# Altium project ZS-001.PrjPcb
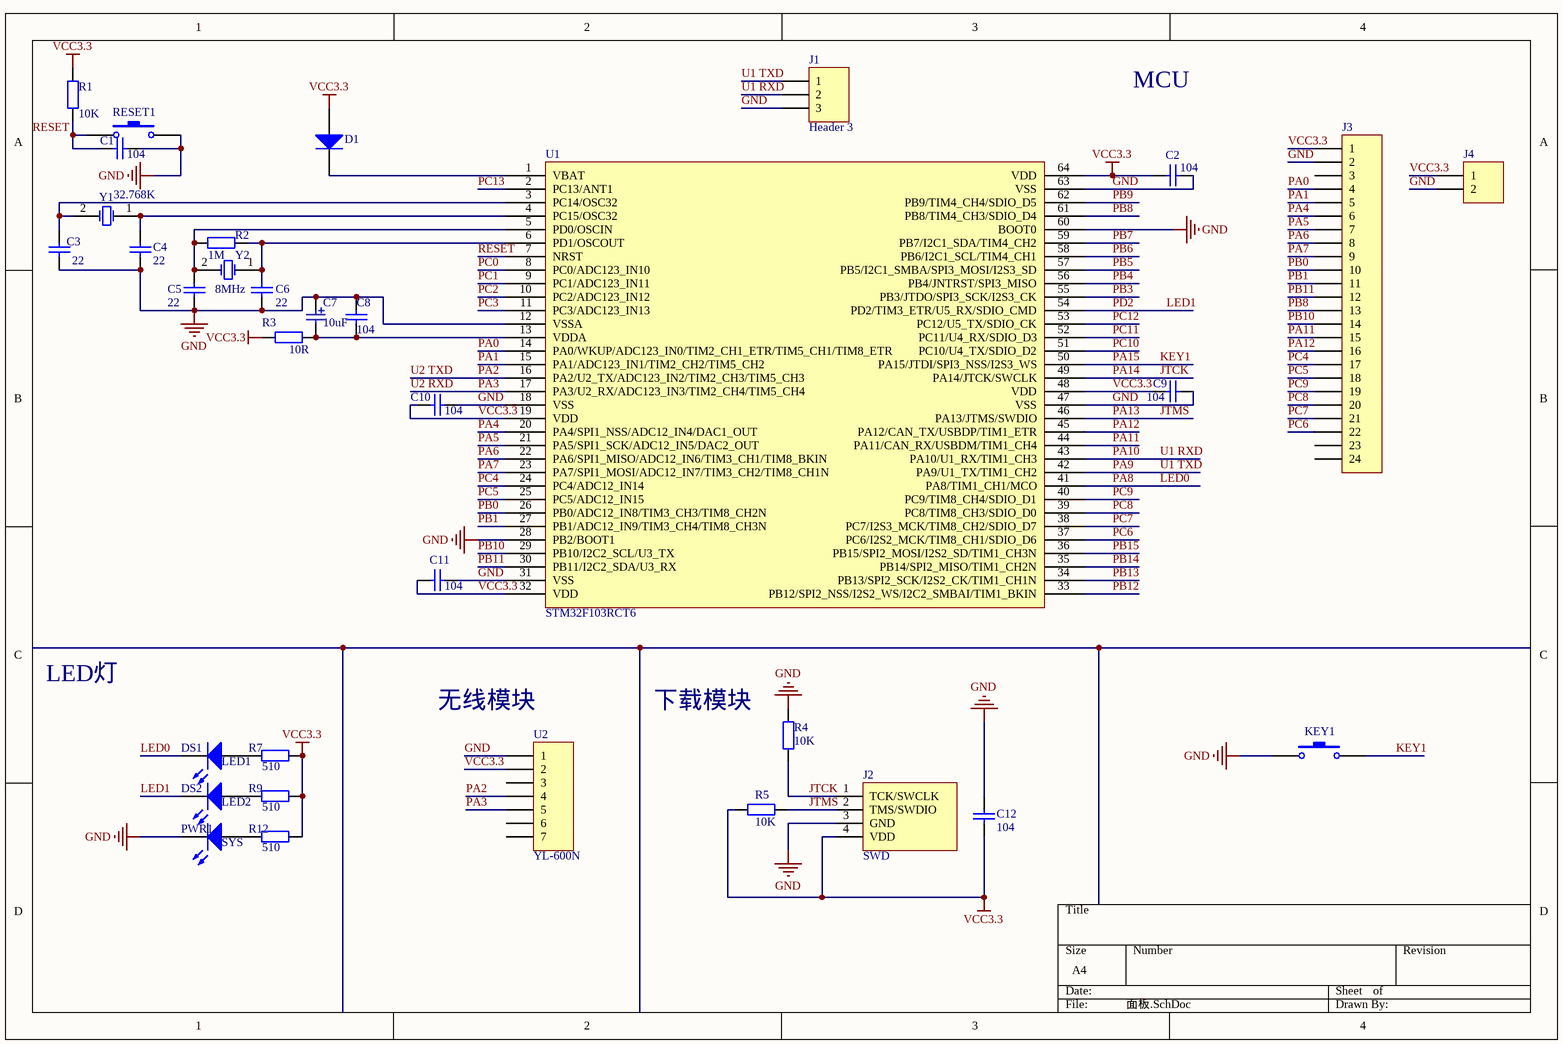
[diagram p0: 面板.SchDoc]
3 sheets, 130 parts. Net scope: global (net labels, ports and power ports of the same name join across sheets).
Board file: Super.PcbDoc
Sheets:
  面板.SchDoc
  基板.SchDoc
  基板1.SchDoc

## Sheet 面板.SchDoc
size A4

### Parts
(Parts that share a designator on the sheet are numbered #1, #2 ... from top to bottom, then left to right.)
C1  value 104  [0805C]  (hidden comment: Cap)
C2  value 104  [0805C]  (hidden comment: Cap)
C3  value 22  [0805C]  (hidden comment: Cap)
C4  value 22  [0805C]  (hidden comment: Cap)
C5  value 22  [0805C]  (hidden comment: Cap)
C6  value 22  [0805C]  (hidden comment: Cap)
C7  10uF  [3216T]
C8  value 104  [0805c]  (hidden comment: Cap)
C9  value 104  [0805C]  (hidden comment: Cap)
C10  value 104  [0805C]  (hidden comment: Cap)
C11  value 104  [0805C]  (hidden comment: Cap)
C12  value 104  [0805C]  (hidden comment: Cap)
D1  Diode 1N914  [1206]  (value not drawn)
DS1  LED1  [0805-D]
DS2  LED2  [0805-D]
J1#1  Header 3  [HDR1X3]
J2#1  SWD  [SWD]
J3#1  Header 24  [ffc]  (value not drawn)
J4#1  Header 2  [HDR1X2]  (value not drawn)
KEY1  SW-PB  [SWITCH]  (value not drawn)
PWR1  SYS  [0805-D]
R1  value 10K  [0805]  (hidden comment: Res2)
R2  value 1M  [0805]  (hidden comment: Res2)
R3  value 10R  [0805]  (hidden comment: Res2)
R4  value 10K  [0805]  (hidden comment: Res2)
R5  value 10K  [0805]  (hidden comment: Res2)
R7  value 510  [0805]
R9#1  value 510  [0805]
R12#1  value 510  [0805]
RESET1  SW-PB  [SWITCH]  (value not drawn)
U1#1  STM32F103RCT6  [STM32F103RCT6]
U2#1  YL-600N  [HDR1X7]
Y1  XTAL  [tc-26]  (value not drawn)
Y2  8MHz  [Y2]

### Nets
GND: C1.2 C2.2 C3.1 C4.1 C5.1 C6.2 C7.1 C8.2 C9.2 C10.1 C11.2 C12.1 J1#1.3 J2#1.3(GND) J3#1.2 J4#1.2 KEY1.1 PWR1.2(K) R4.1 RESET1.2 U1#1.12(VSSA) U1#1.18(VSS) U1#1.28(PB2/BOOT1) U1#1.31(VSS) U1#1.47(VSS) U1#1.60(BOOT0) U1#1.63(VSS) U2#1.1
VCC3.3: C2.1 C9.1 C10.2 C11.1 C12.2 D1.1(A) J2#1.4(VDD) J3#1.1 J4#1.1 R1.2 R3.2 R5.2 R7.2 R9#1.2 R12#1.2 U1#1.19(VDD) U1#1.32(VDD) U1#1.48(VDD) U1#1.64(VDD) U2#1.2
32.768K: C3.2 U1#1.3(PC14/OSC32) Y1.2(OSC2)
JTCK: J2#1.1(TCK/SWCLK) R4.2 U1#1.49(PA14/JTCK/SWCLK)  [also labelled PA14]
JTMS: J2#1.2(TMS/SWDIO) R5.1 U1#1.46(PA13/JTMS/SWDIO)  [also labelled PA13]
KEY1: KEY1.2 U1#1.50(PA15/JTDI/SPI3_NSS/I2S3_WS)  [also labelled PA15]
LED0: DS1.2(K) U1#1.41(PA8/TIM1_CH1/MCO)  [also labelled PA8]
LED1: DS2.2(K) U1#1.54(PD2/TIM3_ETR/U5_RX/SDIO_CMD)  [also labelled PD2]
PA0: J3#1.4 U1#1.14(PA0/WKUP/ADC123_IN0/TIM2_CH1_ETR/TIM5_CH1/TIM8_ETR)
PA1: J3#1.5 U1#1.15(PA1/ADC123_IN1/TIM2_CH2/TIM5_CH2)
PA2: U1#1.16(PA2/U2_TX/ADC123_IN2/TIM2_CH3/TIM5_CH3) U2#1.4  [also labelled U2 TXD]
PA3: U1#1.17(PA3/U2_RX/ADC123_IN3/TIM2_CH4/TIM5_CH4) U2#1.5  [also labelled U2 RXD]
PA4: J3#1.6 U1#1.20(PA4/SPI1_NSS/ADC12_IN4/DAC1_OUT)
PA5: J3#1.7 U1#1.21(PA5/SPI1_SCK/ADC12_IN5/DAC2_OUT)
PA6: J3#1.8 U1#1.22(PA6/SPI1_MISO/ADC12_IN6/TIM3_CH1/TIM8_BKIN)
PA7: J3#1.9 U1#1.23(PA7/SPI1_MOSI/ADC12_IN7/TIM3_CH2/TIM8_CH1N)
PA9: J1#1.1 U1#1.42(PA9/U1_TX/TIM1_CH2)  [also labelled U1 TXD]
PA10: J1#1.2 U1#1.43(PA10/U1_RX/TIM1_CH3)  [also labelled U1 RXD]
PA11: J3#1.15 U1#1.44(PA11/CAN_RX/USBDM/TIM1_CH4)
PA12: J3#1.16 U1#1.45(PA12/CAN_TX/USBDP/TIM1_ETR)
PB0: J3#1.10 U1#1.26(PB0/ADC12_IN8/TIM3_CH3/TIM8_CH2N)
PB1: J3#1.11 U1#1.27(PB1/ADC12_IN9/TIM3_CH4/TIM8_CH3N)
PB3: U1#1.55(PB3/JTDO/SPI3_SCK/I2S3_CK)
PB4: U1#1.56(PB4/JNTRST/SPI3_MISO)
PB5: U1#1.57(PB5/I2C1_SMBA/SPI3_MOSI/I2S3_SD)
PB6: U1#1.58(PB6/I2C1_SCL/TIM4_CH1)
PB7: U1#1.59(PB7/I2C1_SDA/TIM4_CH2)
PB8: J3#1.13 U1#1.61(PB8/TIM4_CH3/SDIO_D4)
PB9: U1#1.62(PB9/TIM4_CH4/SDIO_D5)
PB10: J3#1.14 U1#1.29(PB10/I2C2_SCL/U3_TX)
PB11: J3#1.12 U1#1.30(PB11/I2C2_SDA/U3_RX)
PB12: U1#1.33(PB12/SPI2_NSS/I2S2_WS/I2C2_SMBAI/TIM1_BKIN)
PB13: U1#1.34(PB13/SPI2_SCK/I2S2_CK/TIM1_CH1N)
PB14: U1#1.35(PB14/SPI2_MISO/TIM1_CH2N)
PB15: U1#1.36(PB15/SPI2_MOSI/I2S2_SD/TIM1_CH3N)
PC0: U1#1.8(PC0/ADC123_IN10)
PC1: U1#1.9(PC1/ADC123_IN11)
PC2: U1#1.10(PC2/ADC123_IN12)
PC3: U1#1.11(PC3/ADC123_IN13)
PC4: J3#1.17 U1#1.24(PC4/ADC12_IN14)
PC5: J3#1.18 U1#1.25(PC5/ADC12_IN15)
PC6: J3#1.22 U1#1.37(PC6/I2S2_MCK/TIM8_CH1/SDIO_D6)
PC7: J3#1.21 U1#1.38(PC7/I2S3_MCK/TIM8_CH2/SDIO_D7)
PC8: J3#1.20 U1#1.39(PC8/TIM8_CH3/SDIO_D0)
PC9: J3#1.19 U1#1.40(PC9/TIM8_CH4/SDIO_D1)
PC10: U1#1.51(PC10/U4_TX/SDIO_D2)
PC11: U1#1.52(PC11/U4_RX/SDIO_D3)
PC12: U1#1.53(PC12/U5_TX/SDIO_CK)
PC13: U1#1.2(PC13/ANT1)
RESET: U1#1.7(NRST)
NetC1_1: C1.1 R1.1 RESET1.1
NetC4_2: C4.2 U1#1.4(PC15/OSC32) Y1.1(OSC1)
NetC5_2: C5.2 R2.2 U1#1.5(PD0/OSCIN) Y2.2(OSC2)
NetC6_1: C6.1 R2.1 U1#1.6(PD1/OSCOUT) Y2.1(OSC1)
NetC7_2: C7.2 C8.1 R3.1 U1#1.13(VDDA)
NetD1_2: D1.2(K) U1#1.1(VBAT)
NetDS1_1: DS1.1(A) R7.1
NetDS2_1: DS2.1(A) R9#1.1
NetPWR1_1: PWR1.1(A) R12#1.1

Not connected (* = marked no-connect by the designer): J3#1 3 23 24; U2#1 3 6 7

### Notes on the sheet
- LED灯
- 无线模块
- 下载模块
- Labels drawn without touching a wire or pin: MCU, RESET

### Library data of the parts
C1-C6 C8-C12 = Cap: Capacitor; Published: 8-Jun-2000; LatestRevisionDate: 17-Jul-2002; LatestRevisionNote: Re-released for DXP Platform.; PackageReference: RAD-0.3; Publisher: Altium Limited; PackageDescription: Radial Cap, Thru-Hole; 2 Leads; 0.3 in Pin Spacing
C7 = CAP-POL1
D1 = Diode 1N914: High Conductance Fast Diode; Published: 8-Jun-2000; LatestRevisionDate: 17-Jul-2002; LatestRevisionNote: Re-released for DXP Platform.; DatasheetVersion: 1997; PackageReference: DO-35; Publisher: Altium Limited; PackageDescription: Diode, Axial; Body 3.8 x 1.9 mm (LxDia. max), Lead Dia. 0.53 mm (max); Code_JEDEC: DO-204-AH; ComponentLink1Description: Manufacturer Link; ComponentLink1URL: http://www.fairchildsemi.com/; ComponentLink2Description: Datasheet; ComponentLink2URL: http://www.fairchildsemi.com/ds/1N%2F1N4448.pdf
DS1 DS2 PWR1 = LED0: Typical INFRARED GaAs LED; Published: 8-Jun-2000; LatestRevisionDate: 08-Jul-2005; LatestRevisionNote: Mech Layer 1 removed.; PackageReference: LED-0; Publisher: Altium Limited; PackageDescription: LED; 2 Leads
J1#1 = Header 3: Header, 3-Pin; LatestRevisionDate: 17-Jul-2002; LatestRevisionNote: Re-released for DXP Platform.; Publisher: Altium Limited
J3#1 = Header 24: Header, 24-Pin; LatestRevisionDate: 17-Jul-2002; LatestRevisionNote: Re-released for DXP Platform.; Publisher: Altium Limited
J4#1 = Header 2: Header, 2-Pin; LatestRevisionDate: 17-Jul-2002; LatestRevisionNote: Re-released for DXP Platform.; Publisher: Altium Limited
KEY1 RESET1 = SW-PB: Switch; Published: 24-Mar-1999; LatestRevisionDate: 17-Jul-2002; LatestRevisionNote: Re-released for DXP Platform.; PackageReference: SPST-2; Publisher: Altium Limited; PackageDescription: Switch; 2 Leads
R1-R5 R7 R9#1 R12#1 = Res2: Resistor; Published: 8-Jun-2000; LatestRevisionDate: 17-Jul-2002; LatestRevisionNote: Re-released for DXP Platform.; PackageReference: AXIAL-0.4; Publisher: Altium Limited; PackageDescription: Axial Device, Thru-Hole; 2 Leads; 0.4 in Pin Spacing
U2#1 = Header 7: Header, 7-Pin; LatestRevisionDate: 17-Jul-2002; LatestRevisionNote: Re-released for DXP Platform.; Publisher: Altium Limited
Y1 Y2 = XTAL: Crystal Oscillator; Published: 8-Jun-2000; LatestRevisionDate: 17-Jul-2002; LatestRevisionNote: Re-released for DXP Platform.; PackageReference: R38; Publisher: Altium Limited; PackageDescription: Crystal, Thru-Hole; 2 Leads; Body 3.1 x 8.2 mm (Dia.xH)

## Sheet 基板.SchDoc
size A4
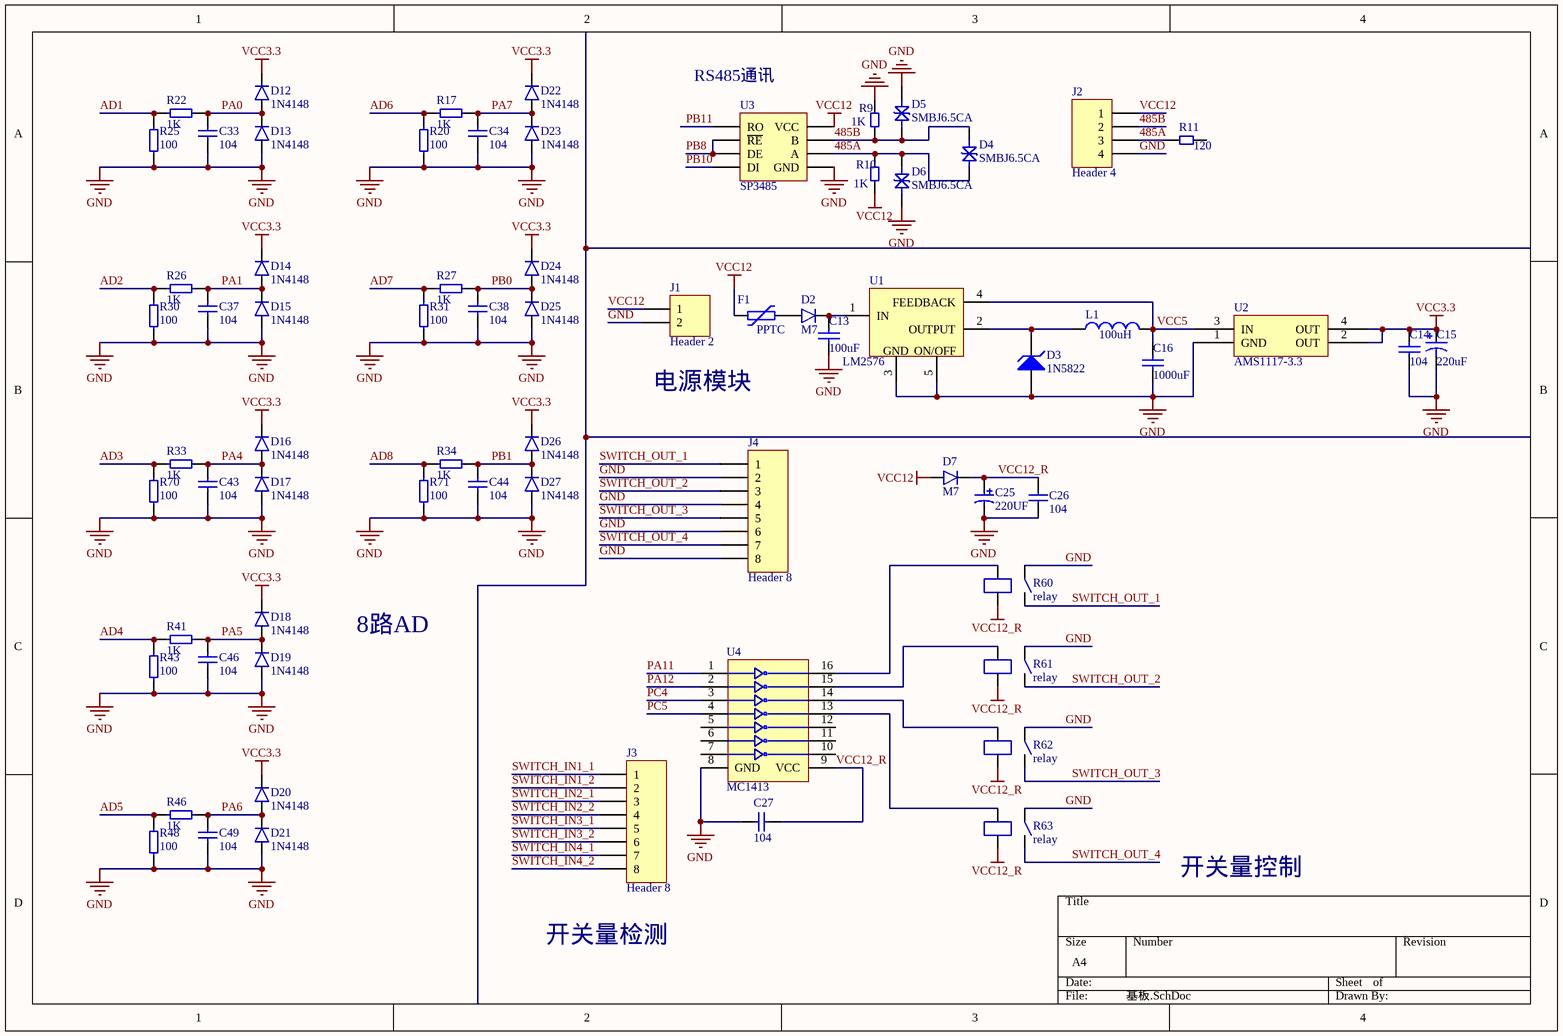
[diagram p1: 基板.SchDoc]

### Parts
(Parts that share a designator on the sheet are numbered #1, #2 ... from top to bottom, then left to right.)
C13  value 100uF  [cap3.3-8 - duplicate]
C14  value 104  [0805]  (hidden comment: Cap)
C15  value 220uF  [C15]  (hidden comment: Cap Pol1)
C16  value 1000uF  [C16]
C25  220UF  [RB 2.5/6.3]
C26  104  [0805C]
C27  104  [0805C]
C33  104  [0805C]
C34  104  [0805C]
C37  104  [0805C]
C38  104  [0805C]
C43  104  [0805C]
C44  104  [0805C]
C46  104  [0805C]
C49  104  [0805C]
D2  M7  [SMA (DO-214AC)]
D3  1N5822  [smb do214aa]
D4  SMBJ6.5CA  [smb do214aa]
D5  SMBJ6.5CA  [smb do214aa]
D6  SMBJ6.5CA  [smb do214aa]
D7  M7  [SMA (DO-214AC)]
D12  1N4148  [SOD 323]
D13  1N4148  [SOD 323]
D14  1N4148  [SOD 323]
D15  1N4148  [SOD 323]
D16  1N4148  [SOD 323]
D17  1N4148  [SOD 323]
D18  1N4148  [SOD 323]
D19  1N4148  [SOD 323]
D20  1N4148  [SOD 323]
D21  1N4148  [SOD 323]
D22  1N4148  [SOD 323]
D23  1N4148  [SOD 323]
D24  1N4148  [SOD 323]
D25  1N4148  [SOD 323]
D26  1N4148  [SOD 323]
D27  1N4148  [SOD 323]
F1  PPTC  [1206]
J1#2  Header 2  [J1_2P]
J2#2  Header 4  [J2_4P]
J3#2  Header 8  [J3_8P]
J4#2  Header 8  [J3_8P]
L1  value 100uH  [l1212]
R9#2  1K  [0805]
R10  1K  [0805]
R11  120  [0805]
R17  1K  [0805R]
R20  100  [0805R]
R22  1K  [0805R]
R25  100  [0805R]
R26  1K  [0805R]
R27  1K  [0805R]
R30  100  [0805R]
R31  100  [0805R]
R33  1K  [0805R]
R34  1K  [0805R]
R41  1K  [0805R]
R43  100  [0805R]
R46  1K  [0805R]
R48  100  [0805R]
R60  relay  [HF49FD/012-1H11]
R61  relay  [HF49FD/012-1H11]
R62  relay  [HF49FD/012-1H11]
R63  relay  [HF49FD/012-1H11]
R70  100  [0805R]
R71  100  [0805R]
U1#2  LM2576  [TO-263-5]
U2#2  AMS1117-3.3  [AMS1117-3.3]
U3  SP3485  [sop8]
U4  MC1413  [SOP 16-1.27/3.9]

### Nets
GND: C13.1 C14.1 C15.2 C16.1 C25.1 C26.1 C27.1 C33.1 C34.1 C37.1 C38.1 C43.1 C44.1 C46.1 C49.1 D3.1(A) D5.1 D6.2 D13.2(+) D15.2(+) D17.2(+) D19.2(+) D21.2(+) D23.2(+) D25.2(+) D27.2(+) J1#2.2 J2#2.4 J4#2.2 J4#2.4 J4#2.6 J4#2.8 R9#2.2 R20.1 R25.1 R30.1 R31.1 R43.1 R48.1 R60.3 R61.3 R62.3 R63.3 R70.1 R71.1 U1#2.3 U1#2.5 U2#2.1(GND) U3.5(GND) U4.8(GND)
VCC3.3: C14.2 C15.1 D12.1(-) D14.1(-) D16.1(-) D18.1(-) D20.1(-) D22.1(-) D24.1(-) D26.1(-) U2#2.2(OUT) U2#2.4(OUT)
VCC12: D7.2(+) F1.1 J1#2.1 J2#2.1 R10.1 U3.8(VCC)
VCC12_R: C25.2 C26.2 C27.2 D7.1(-) R60.2 R61.2 R62.2 R63.2 U4.9(VCC)
485A: D4.2 D6.1 J2#2.3 R10.2 R11.2 U3.6(A)
485B: D4.1 D5.2 J2#2.2 R9#2.1 U3.7(B)
AD1: R22.2 R25.2
AD2: R26.2 R30.2
AD3: R33.2 R70.2
AD4: R41.2 R43.2
AD5: R46.2 R48.2
AD6: R17.2 R20.2
AD7: R27.2 R31.2
AD8: R34.2 R71.2
PA0: C33.2 D12.2(+) D13.1(-) R22.1
PA1: C37.2 D14.2(+) D15.1(-) R26.1
PA4: C43.2 D16.2(+) D17.1(-) R33.1
PA5: C46.2 D18.2(+) D19.1(-) R41.1
PA6: C49.2 D20.2(+) D21.1(-) R46.1
PA7: C34.2 D22.2(+) D23.1(-) R17.1
PA11: U4.1
PA12: U4.2
PB0: C38.2 D24.2(+) D25.1(-) R27.1
PB1: C44.2 D26.2(+) D27.1(-) R34.1
PB8: U3.2(~{RE}) U3.3(DE)
PB10: U3.4(DI)
PB11: U3.1(RO)
PC4: U4.3
PC5: U4.4
SWITCH_IN1_1: J3#2.1
SWITCH_IN1_2: J3#2.2
SWITCH_IN2_1: J3#2.3
SWITCH_IN2_2: J3#2.4
SWITCH_IN3_1: J3#2.5
SWITCH_IN3_2: J3#2.6
SWITCH_IN4_1: J3#2.7
SWITCH_IN4_2: J3#2.8
SWITCH_OUT_1: J4#2.1 R60.4
SWITCH_OUT_2: J4#2.3 R61.4
SWITCH_OUT_3: J4#2.5 R62.4
SWITCH_OUT_4: J4#2.7 R63.4
VCC5: C16.2 L1.2 U1#2.4(FEEDBACK) U2#2.3(IN)
NetC13_2: C13.2 D2.1(-) U1#2.1(IN)
NetD2_2: D2.2(+) F1.2
NetD3_2: D3.2(K) L1.1 U1#2.2(OUTPUT)
NetR60_1: R60.1 U4.16
NetR61_1: R61.1 U4.15
NetR62_1: R62.1 U4.14
NetR63_1: R63.1 U4.13

Not connected (* = marked no-connect by the designer): R11 1; U4 5 6 7 10 11 12

### Notes on the sheet
- (near U3) RS485通讯
- (near U1#2) GND
- (near U1#2) ON/OFF
- 8路AD
- Labels drawn without touching a wire or pin: 开关量控制, 开关量检测, 电源模块

### Library data of the parts
C13 C14 C16 = Cap: Capacitor; Published: 8-Jun-2000; LatestRevisionDate: 17-Jul-2002; LatestRevisionNote: Re-released for DXP Platform.; PackageReference: RAD-0.3; Publisher: Altium Limited; PackageDescription: Radial Cap, Thru-Hole; 2 Leads; 0.3 in Pin Spacing
C15 = Cap Pol1: Polarized Capacitor (Radial); Published: 8-Jun-2000; LatestRevisionDate: 17-Jul-2002; LatestRevisionNote: Re-released for DXP Platform.; PackageReference: RB7.6-15; Publisher: Altium Limited; PackageDescription: Polarized Capacitor (Radial); 2 Leads
C25 = CAP-POL2
C26 C27 C33 C34 C37 C38 C43 C44 C46 C49 = CAP
D3 = D Zener: Zener Diode; Published: 8-Jun-2000; LatestRevisionDate: 17-Jul-2002; LatestRevisionNote: Re-released for DXP Platform.; PackageReference: DIODE-0.7; Publisher: Altium Limited; PackageDescription: Diode, Thru-Hole; 2 Leads; 0.7 in Pin Spacing
J1#2 = Header 2: Header, 2-Pin; LatestRevisionDate: 17-Jul-2002; LatestRevisionNote: Re-released for DXP Platform.; Publisher: Altium Limited
J2#2 = Header 4: Header, 4-Pin; LatestRevisionDate: 17-Jul-2002; LatestRevisionNote: Re-released for DXP Platform.; Publisher: Altium Limited
J3#2 J4#2 = Header 8: Header, 8-Pin; LatestRevisionDate: 17-Jul-2002; LatestRevisionNote: Re-released for DXP Platform.; Publisher: Altium Limited
L1 = Inductor: Code_IEC: 1005; Published: 8-Jun-2000; LatestRevisionDate: 29-May-2009; LatestRevisionNote: IPC-7351 Footprint Added.; PackageReference: 0402-A; Publisher: Altium Limited; PackageDescription: Chip Inductor; Code_JEITA: 0402
R9#2 R10 R11 = Res
R17 R20 R22 R25-R27 R30 R31 R33 R34 R41 R43 R46 R48 R70 R71 = RES

## Sheet 基板1.SchDoc
size A4
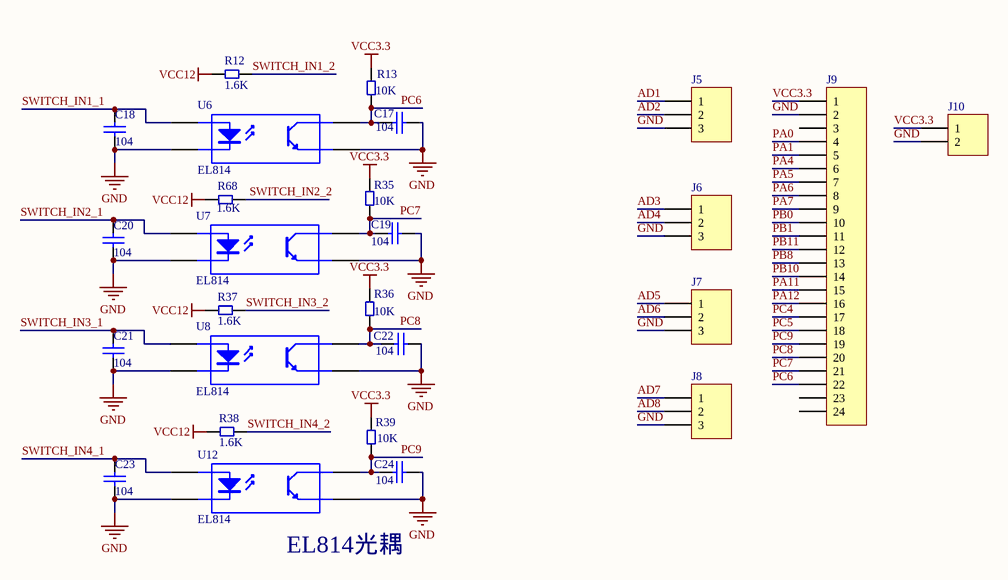
[diagram p2: 基板1.SchDoc]

### Parts
(Parts that share a designator on the sheet are numbered #1, #2 ... from top to bottom, then left to right.)
C17  value 104  [0805C]
C18  value 104  [0805C]
C19  value 104  [0805C]
C20  value 104  [0805C]
C21  value 104  [0805C]
C22  value 104  [0805C]
C23  value 104  [0805C]
C24  value 104  [0805C]
J5  Header 3  [J5_3P]  (value not drawn)
J6  Header 3  [J5_3P]  (value not drawn)
J7  Header 3  [J5_3P]  (value not drawn)
J8  Header 3  [J5_3P]  (value not drawn)
J9  Header 24  [ffc]  (value not drawn)
J10  Header 2  [HDR1X2]  (value not drawn)
R12#2  1.6K  [0805]
R13  10K  [0805]
R35  10K  [0805]
R36  10K  [0805]
R37  1.6K  [0805]
R38  1.6K  [0805]
R39  10K  [0805]
R68  1.6K  [0805]
U6  EL814  [SOP4]
U7  EL814  [SOP4]
U8  EL814  [SOP4]
U12  EL814  [SOP4]

### Nets
GND: C17.1 C18.1 C19.1 C20.1 C21.1 C22.1 C23.1 C24.1 J5.3 J6.3 J7.3 J8.3 J9.2 J10.2 U6.2(K) U6.3(E) U7.2(K) U7.3(E) U8.2(K) U8.3(E) U12.2(K) U12.3(E)
VCC3.3: J9.1 J10.1 R13.1 R35.1 R36.1 R39.1
VCC12: R12#2.1 R37.1 R38.1 R68.1
AD1: J5.1
AD2: J5.2
AD3: J6.1
AD4: J6.2
AD5: J7.1
AD6: J7.2
AD7: J8.1
AD8: J8.2
PA0: J9.4
PA1: J9.5
PA4: J9.6
PA5: J9.7
PA6: J9.8
PA7: J9.9
PA11: J9.15
PA12: J9.16
PB0: J9.10
PB1: J9.11
PB8: J9.13
PB10: J9.14
PB11: J9.12
PC4: J9.17
PC5: J9.18
PC6: C17.2 J9.22 R13.2 U6.4(C)
PC7: C19.2 J9.21 R35.2 U7.4(C)
PC8: C22.2 J9.20 R36.2 U8.4(C)
PC9: C24.2 J9.19 R39.2 U12.4(C)
SWITCH_IN1_1: C18.2 U6.1(A)
SWITCH_IN1_2: R12#2.2
SWITCH_IN2_1: C20.2 U7.1(A)
SWITCH_IN2_2: R68.2
SWITCH_IN3_1: C21.2 U8.1(A)
SWITCH_IN3_2: R37.2
SWITCH_IN4_1: C23.2 U12.1(A)
SWITCH_IN4_2: R38.2

Not connected (* = marked no-connect by the designer): J9 3 23 24

### Notes on the sheet
- Labels drawn without touching a wire or pin: EL814光耦

### Library data of the parts
C17-C24 = Cap: Capacitor; Published: 8-Jun-2000; LatestRevisionDate: 17-Jul-2002; LatestRevisionNote: Re-released for DXP Platform.; PackageReference: RAD-0.3; Publisher: Altium Limited; PackageDescription: Radial Cap, Thru-Hole; 2 Leads; 0.3 in Pin Spacing
J5-J8 = Header 3: Header, 3-Pin; LatestRevisionDate: 17-Jul-2002; LatestRevisionNote: Re-released for DXP Platform.; Publisher: Altium Limited
J9 = Header 24: Header, 24-Pin; LatestRevisionDate: 17-Jul-2002; LatestRevisionNote: Re-released for DXP Platform.; Publisher: Altium Limited
J10 = Header 2: Header, 2-Pin; LatestRevisionDate: 17-Jul-2002; LatestRevisionNote: Re-released for DXP Platform.; Publisher: Altium Limited
R12#2 R13 R35-R39 R68 = Res
U6-U8 U12 = TLP281

## Nets that join several sheets
GND: 面板 (28 pins), 基板 (50 pins), 基板1 (22 pins)
VCC3.3: 面板 (20 pins), 基板 (12 pins), 基板1 (6 pins)
VCC12: 基板 (6 pins), 基板1 (R12#2.1 R37.1 R38.1 R68.1)
AD1: 基板 (R22.2 R25.2), 基板1 (J5.1)
AD2: 基板 (R26.2 R30.2), 基板1 (J5.2)
AD3: 基板 (R33.2 R70.2), 基板1 (J6.1)
AD4: 基板 (R41.2 R43.2), 基板1 (J6.2)
AD5: 基板 (R46.2 R48.2), 基板1 (J7.1)
AD6: 基板 (R17.2 R20.2), 基板1 (J7.2)
AD7: 基板 (R27.2 R31.2), 基板1 (J8.1)
AD8: 基板 (R34.2 R71.2), 基板1 (J8.2)
PA0: 面板 (J3#1.4 U1#1.14), 基板 (C33.2 D12.2 D13.1 R22.1), 基板1 (J9.4)
PA1: 面板 (J3#1.5 U1#1.15), 基板 (C37.2 D14.2 D15.1 R26.1), 基板1 (J9.5)
PA4: 面板 (J3#1.6 U1#1.20), 基板 (C43.2 D16.2 D17.1 R33.1), 基板1 (J9.6)
PA5: 面板 (J3#1.7 U1#1.21), 基板 (C46.2 D18.2 D19.1 R41.1), 基板1 (J9.7)
PA6: 面板 (J3#1.8 U1#1.22), 基板 (C49.2 D20.2 D21.1 R46.1), 基板1 (J9.8)
PA7: 面板 (J3#1.9 U1#1.23), 基板 (C34.2 D22.2 D23.1 R17.1), 基板1 (J9.9)
PA11: 面板 (J3#1.15 U1#1.44), 基板 (U4.1), 基板1 (J9.15)
PA12: 面板 (J3#1.16 U1#1.45), 基板 (U4.2), 基板1 (J9.16)
PB0: 面板 (J3#1.10 U1#1.26), 基板 (C38.2 D24.2 D25.1 R27.1), 基板1 (J9.10)
PB1: 面板 (J3#1.11 U1#1.27), 基板 (C44.2 D26.2 D27.1 R34.1), 基板1 (J9.11)
PB8: 面板 (J3#1.13 U1#1.61), 基板 (U3.2 U3.3), 基板1 (J9.13)
PB10: 面板 (J3#1.14 U1#1.29), 基板 (U3.4), 基板1 (J9.14)
PB11: 面板 (J3#1.12 U1#1.30), 基板 (U3.1), 基板1 (J9.12)
PC4: 面板 (J3#1.17 U1#1.24), 基板 (U4.3), 基板1 (J9.17)
PC5: 面板 (J3#1.18 U1#1.25), 基板 (U4.4), 基板1 (J9.18)
PC6: 面板 (J3#1.22 U1#1.37), 基板1 (C17.2 J9.22 R13.2 U6.4)
PC7: 面板 (J3#1.21 U1#1.38), 基板1 (C19.2 J9.21 R35.2 U7.4)
PC8: 面板 (J3#1.20 U1#1.39), 基板1 (C22.2 J9.20 R36.2 U8.4)
PC9: 面板 (J3#1.19 U1#1.40), 基板1 (C24.2 J9.19 R39.2 U12.4)
SWITCH_IN1_1: 基板 (J3#2.1), 基板1 (C18.2 U6.1)
SWITCH_IN1_2: 基板 (J3#2.2), 基板1 (R12#2.2)
SWITCH_IN2_1: 基板 (J3#2.3), 基板1 (C20.2 U7.1)
SWITCH_IN2_2: 基板 (J3#2.4), 基板1 (R68.2)
SWITCH_IN3_1: 基板 (J3#2.5), 基板1 (C21.2 U8.1)
SWITCH_IN3_2: 基板 (J3#2.6), 基板1 (R37.2)
SWITCH_IN4_1: 基板 (J3#2.7), 基板1 (C23.2 U12.1)
SWITCH_IN4_2: 基板 (J3#2.8), 基板1 (R38.2)